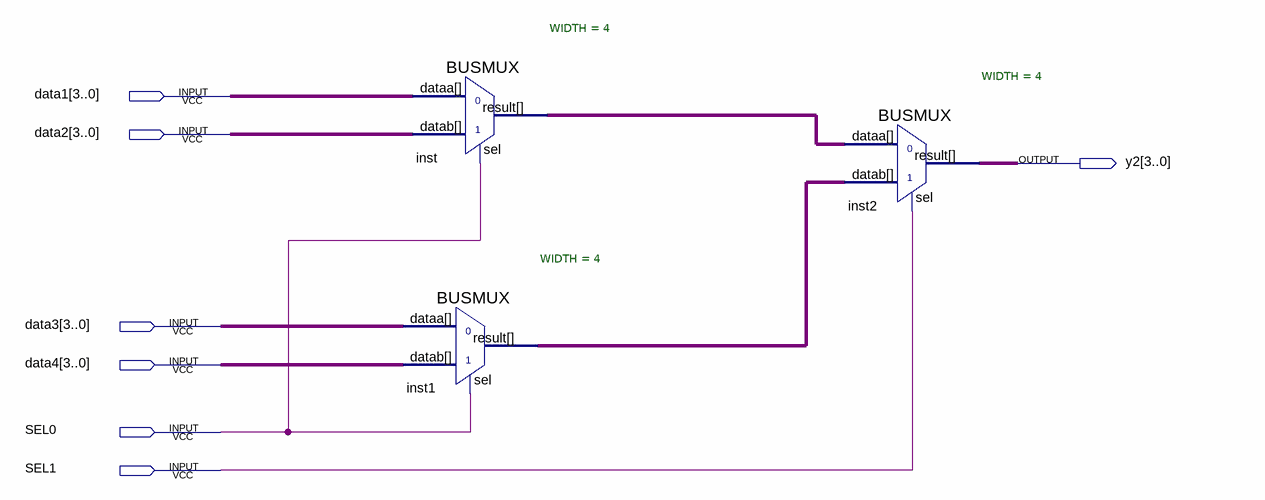
[diagram p0: schematic sheet]
// Quartus schematic Mux4x4bitsx4bits.bdf as structural Verilog: 3 symbols, 7 pins
module Mux4x4bitsx4bits (
  input  [3:0] data1,
  input  [3:0] data2,
  input  [3:0] data3,
  input  [3:0] data4,
  input  SEL0,
  input  SEL1,
  output [3:0] y2
);

  wire [3:0] inst1_result, inst_result;

  BUSMUX #(.WIDTH(4)) inst (.datab(data2), .sel(SEL0), .dataa(data1), .result(inst_result));
  BUSMUX #(.WIDTH(4)) inst1 (.datab(data4), .sel(SEL0), .dataa(data3), .result(inst1_result));
  BUSMUX #(.WIDTH(4)) inst2 (.datab(inst1_result), .sel(SEL1), .dataa(inst_result), .result(y2));
endmodule
